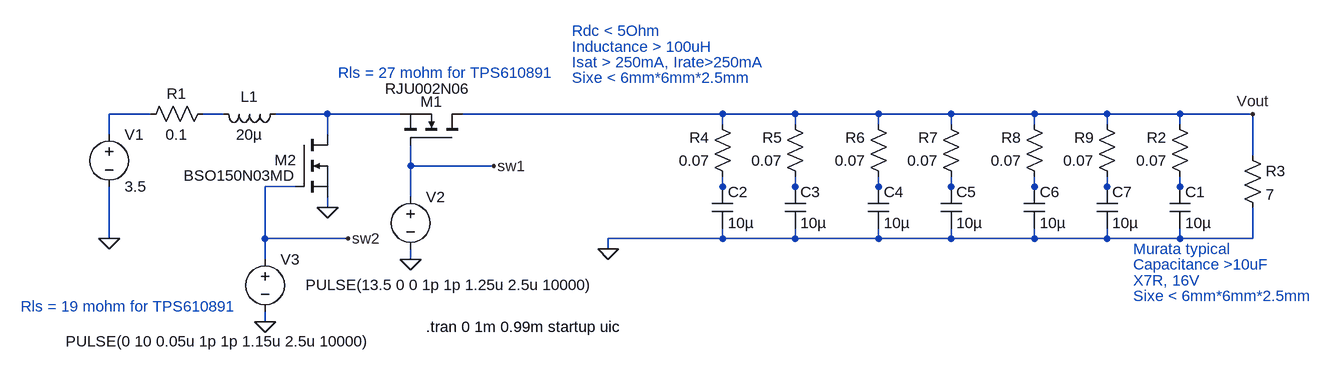
[diagram p0: schematic BoostConceptral.asc]
BoostConceptral.asc, the LTspice schematic file:
Version 4
SHEET 1 1276 680
WIRE -544 112 -608 112
WIRE -432 112 -464 112
WIRE -272 112 -352 112
WIRE -160 112 -272 112
WIRE 336 112 -64 112
WIRE 448 112 336 112
WIRE 576 112 448 112
WIRE 688 112 576 112
WIRE 816 112 688 112
WIRE 928 112 816 112
WIRE 1040 112 928 112
WIRE 1152 112 1040 112
WIRE 336 128 336 112
WIRE 448 128 448 112
WIRE 576 128 576 112
WIRE 688 128 688 112
WIRE 816 128 816 112
WIRE 928 128 928 112
WIRE 1040 128 1040 112
WIRE -608 144 -608 112
WIRE -272 144 -272 112
WIRE 1152 176 1152 112
WIRE -144 192 -144 160
WIRE -16 192 -144 192
WIRE -320 224 -368 224
WIRE 336 224 336 208
WIRE 448 224 448 208
WIRE 576 224 576 208
WIRE 688 224 688 208
WIRE 816 224 816 208
WIRE 928 224 928 208
WIRE 1040 224 1040 208
WIRE -144 240 -144 192
WIRE 336 240 336 224
WIRE 448 240 448 224
WIRE 576 240 576 224
WIRE 688 240 688 224
WIRE 816 240 816 224
WIRE 928 240 928 224
WIRE 1040 240 1040 224
WIRE -272 256 -272 240
WIRE -608 304 -608 224
WIRE -368 304 -368 224
WIRE -240 304 -368 304
WIRE 336 304 336 288
WIRE 336 304 160 304
WIRE 448 304 448 288
WIRE 448 304 336 304
WIRE 576 304 576 288
WIRE 576 304 448 304
WIRE 688 304 688 288
WIRE 688 304 576 304
WIRE 816 304 816 288
WIRE 816 304 688 304
WIRE 928 304 928 288
WIRE 928 304 816 304
WIRE 1040 304 1040 288
WIRE 1040 304 928 304
WIRE 1152 304 1152 256
WIRE 1152 304 1040 304
WIRE 160 320 160 304
WIRE -368 336 -368 304
WIRE -144 336 -144 320
WIRE -368 432 -368 416
FLAG 160 320 0
FLAG -608 304 0
FLAG -144 336 0
FLAG -368 432 0
FLAG 1152 112 Vout
FLAG -16 192 sw1
FLAG -240 304 sw2
FLAG -272 256 0
SYMBOL ind -336 96 R90
WINDOW 0 5 56 VBottom 2
WINDOW 3 32 56 VTop 2
SYMATTR InstName L1
SYMATTR Value 20µ
SYMBOL cap 1024 224 R0
SYMATTR InstName C1
SYMATTR Value 10µ
SYMBOL res -448 96 R90
WINDOW 0 0 56 VBottom 2
WINDOW 3 32 56 VTop 2
SYMATTR InstName R1
SYMATTR Value 0.1
SYMBOL res 1056 224 R180
WINDOW 0 36 76 Left 2
WINDOW 3 36 40 Left 2
SYMATTR InstName R2
SYMATTR Value 0.07
SYMBOL res 1136 160 R0
SYMATTR InstName R3
SYMATTR Value 7
SYMBOL voltage -608 128 R0
WINDOW 123 0 0 Left 2
WINDOW 39 0 0 Left 2
SYMATTR InstName V1
SYMATTR Value 3.5
SYMBOL nmos -320 144 R0
WINDOW 3 -173 63 Left 2
WINDOW 0 -33 39 Left 2
SYMATTR Value BSO150N03MD
SYMATTR InstName M2
SYMBOL voltage -144 224 R0
WINDOW 123 0 0 Left 2
WINDOW 39 0 0 Left 2
WINDOW 3 -162 151 Left 2
SYMATTR InstName V2
SYMATTR Value PULSE(13.5 0 0 1p 1p 1.25u 2.5u 10000)
SYMBOL voltage -368 320 R0
WINDOW 3 -307 142 Left 2
WINDOW 123 0 0 Left 2
WINDOW 39 0 0 Left 2
SYMATTR Value PULSE(0 10 0.05u 1p 1p 1.15u 2.5u 10000)
SYMATTR InstName V3
SYMBOL nmos -64 160 M270
WINDOW 0 67 31 VRight 2
WINDOW 3 87 119 VLeft 2
SYMATTR InstName M1
SYMATTR Value RJU002N06
SYMBOL cap 320 224 R0
SYMATTR InstName C2
SYMATTR Value 10µ
SYMBOL res 352 224 R180
WINDOW 0 36 76 Left 2
WINDOW 3 36 40 Left 2
SYMATTR InstName R4
SYMATTR Value 0.07
SYMBOL cap 432 224 R0
SYMATTR InstName C3
SYMATTR Value 10µ
SYMBOL res 464 224 R180
WINDOW 0 36 76 Left 2
WINDOW 3 36 40 Left 2
SYMATTR InstName R5
SYMATTR Value 0.07
SYMBOL cap 560 224 R0
SYMATTR InstName C4
SYMATTR Value 10µ
SYMBOL res 592 224 R180
WINDOW 0 36 76 Left 2
WINDOW 3 36 40 Left 2
SYMATTR InstName R6
SYMATTR Value 0.07
SYMBOL cap 672 224 R0
SYMATTR InstName C5
SYMATTR Value 10µ
SYMBOL res 704 224 R180
WINDOW 0 36 76 Left 2
WINDOW 3 36 40 Left 2
SYMATTR InstName R7
SYMATTR Value 0.07
SYMBOL cap 800 224 R0
SYMATTR InstName C6
SYMATTR Value 10µ
SYMBOL res 832 224 R180
WINDOW 0 36 76 Left 2
WINDOW 3 36 40 Left 2
SYMATTR InstName R8
SYMATTR Value 0.07
SYMBOL cap 912 224 R0
SYMATTR InstName C7
SYMATTR Value 10µ
SYMBOL res 944 224 R180
WINDOW 0 36 76 Left 2
WINDOW 3 36 40 Left 2
SYMATTR InstName R9
SYMATTR Value 0.07
TEXT -120 440 Left 2 !.tran 0 1m 0.99m startup uic
TEXT 104 56 Left 2 ;Sixe < 6mm*6mm*2.5mm
TEXT 104 32 Left 2 ;Isat > 250mA, Irate>250mA
TEXT 104 8 Left 2 ;Inductance > 100uH
TEXT 104 -16 Left 2 ;Rdc < 5Ohm
TEXT 968 392 Left 2 ;Sixe < 6mm*6mm*2.5mm
TEXT 968 368 Left 2 ;X7R, 16V
TEXT 968 344 Left 2 ;Capacitance >10uF
TEXT 968 320 Left 2 ;Murata typical
TEXT -256 48 Left 2 ;Rls = 27 mohm for TPS610891
TEXT -744 408 Left 2 ;Rls = 19 mohm for TPS610891

The netlist it stands for:
* BoostConceptral.asc
L1 N003 N002 20µ
C1 N010 0 10µ
R1 N002 N001 0.1
R2 N010 Vout 0.07
R3 Vout 0 7
V1 N001 0 3.5
M2 N003 sw2 0 0 BSO150N03MD
V2 sw1 0 PULSE(13.5 0 0 1p 1p 1.25u 2.5u 10000)
V3 sw2 0 PULSE(0 10 0.05u 1p 1p 1.15u 2.5u 10000)
M1 Vout sw1 N003 N003 RJU002N06
C2 N004 0 10µ
R4 N004 Vout 0.07
C3 N005 0 10µ
R5 N005 Vout 0.07
C4 N006 0 10µ
R6 N006 Vout 0.07
C5 N007 0 10µ
R7 N007 Vout 0.07
C6 N008 0 10µ
R8 N008 Vout 0.07
C7 N009 0 10µ
R9 N009 Vout 0.07
.model NMOS NMOS
.model PMOS PMOS
.lib standard.mos
.tran 0 1m 0.99m startup uic
* Sixe < 6mm*6mm*2.5mm
* Isat > 250mA, Irate>250mA
* Inductance > 100uH
* Rdc < 5Ohm
* Sixe < 6mm*6mm*2.5mm
* X7R, 16V
* Capacitance >10uF
* Murata typical
* Rls = 27 mohm for TPS610891
* Rls = 19 mohm for TPS610891
.backanno
.end